# Altium schematic sheet 3-LoadDrivers.SchDoc
size A4
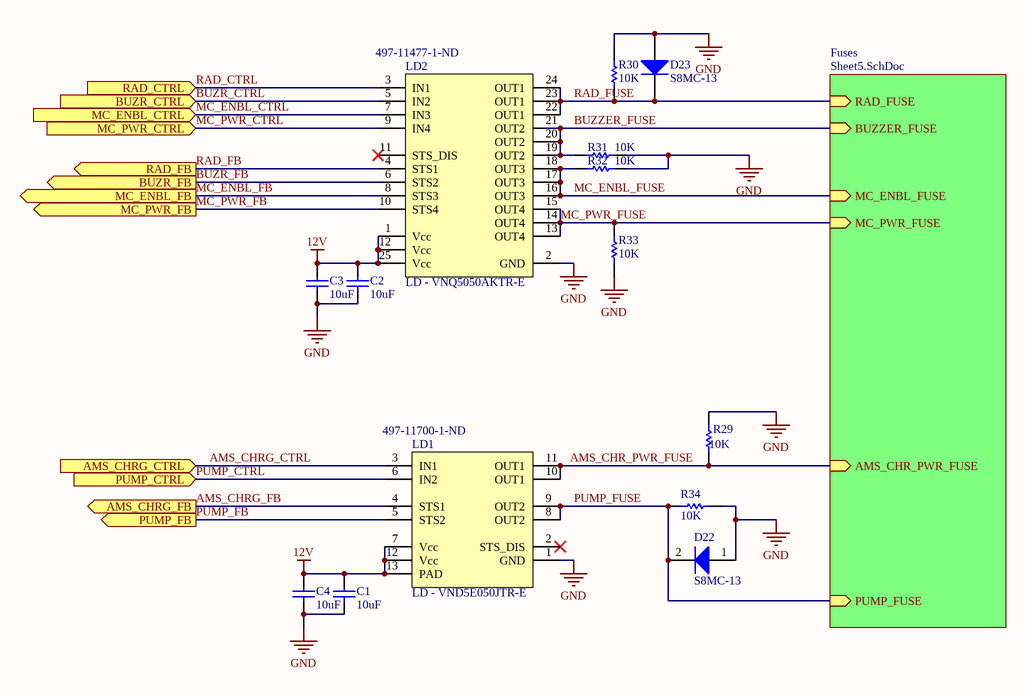
[diagram p0: 3-LoadDrivers.SchDoc]

## Parts
C1  value 10uF  [1608[0603]]  (hidden comment: Cap Semi)
C2  value 10uF  [1608[0603]]  (hidden comment: Cap Semi)
C3  value 10uF  [1608[0603]]  (hidden comment: Cap Semi)
C4  value 10uF  [1608[0603]]  (hidden comment: Cap Semi)
D22  S8MC-13  [S8MC-13]
D23  S8MC-13  [S8MC-13]
LD1  LD - VND5E050JTR-E  Supplier Part Number 1: 497-11700-1-ND
LD2  LD - VNQ5050AKTR-E  Supplier Part Number 1: 497-11477-1-ND  [24-SOP (0.295", 7.50mm Width) Exposed Pad]
R29  10K  [RESC0603(1608)_L]
R30  10K  [RESC0603(1608)_L]
R31  10K  [RESC0603(1608)_L]
R32  10K  [RESC0603(1608)_L]
R33  10K  [RESC0603(1608)_L]
R34  10K  [RESC0603(1608)_L]

## Sub-sheets
Fuses = Sheet5.SchDoc: RAD_FUSE (in), PUMP_FUSE (in), MC_PWR_FUSE (in), MC_ENBL_FUSE (in), BUZZER_FUSE (in), AMS_CHR_PWR_FUSE (in)

## Ports
AMS_CHRG_CTRL (in), AMS_CHRG_FB (out), BUZR_CTRL (in), BUZR_FB (out), MC_ENBL_CTRL (in), MC_ENBL_FB (out), MC_PWR_CTRL (in), MC_PWR_FB (out), PUMP_CTRL (in), PUMP_FB (out), RAD_CTRL (in), RAD_FB (out)

## Nets
12V: C1.2 C2.2 C3.2 C4.2 LD1.7(Vcc) LD1.12(Vcc) LD1.13(PAD) LD2.1(Vcc) LD2.12(Vcc) LD2.25(Vcc)
GND: C1.1 C2.1 C3.1 C4.1 D22.1(A) D23.1(A) LD1.1(GND) LD2.2(GND) R29.2 R30.2 R31.2 R32.2 R33.1 R34.1
AMS_CHR_PWR_FUSE: LD1.10(OUT1) LD1.11(OUT1) R29.1 ; sheet Fuses/AMS_CHR_PWR_FUSE
AMS_CHRG_CTRL: LD1.3(IN1) ; port AMS_CHRG_CTRL
AMS_CHRG_FB: LD1.4(STS1) ; port AMS_CHRG_FB
BUZR_CTRL: LD2.5(IN2) ; port BUZR_CTRL
BUZR_FB: LD2.6(STS2) ; port BUZR_FB
BUZZER_FUSE: LD2.19(OUT2) LD2.20(OUT2) LD2.21(OUT2) R31.1 ; sheet Fuses/BUZZER_FUSE
MC_ENBL_CTRL: LD2.7(IN3) ; port MC_ENBL_CTRL
MC_ENBL_FB: LD2.8(STS3) ; port MC_ENBL_FB
MC_ENBL_FUSE: LD2.16(OUT3) LD2.17(OUT3) LD2.18(OUT3) R32.1 ; sheet Fuses/MC_ENBL_FUSE
MC_PWR_CTRL: LD2.9(IN4) ; port MC_PWR_CTRL
MC_PWR_FB: LD2.10(STS4) ; port MC_PWR_FB
MC_PWR_FUSE: LD2.13(OUT4) LD2.14(OUT4) LD2.15(OUT4) R33.2 ; sheet Fuses/MC_PWR_FUSE
PUMP_CTRL: LD1.6(IN2) ; port PUMP_CTRL
PUMP_FB: LD1.5(STS2) ; port PUMP_FB
PUMP_FUSE: D22.2(K) LD1.8(OUT2) LD1.9(OUT2) R34.2 ; sheet Fuses/PUMP_FUSE
RAD_CTRL: LD2.3(IN1) ; port RAD_CTRL
RAD_FB: LD2.4(STS1) ; port RAD_FB
RAD_FUSE: D23.2(K) LD2.22(OUT1) LD2.23(OUT1) LD2.24(OUT1) R30.1 ; sheet Fuses/RAD_FUSE

Not connected (* = marked no-connect by the designer): LD1 2(STS_DIS)*; LD2 11(STS_DIS)*

## Library data of the parts
C1-C4 = Cap Semi: Capacitor (Semiconductor SIM Model); Published: 8-Jun-2000; LatestRevisionDate: 29-May-2009; LatestRevisionNote: IPC-7351 Footprint Added.; PackageReference: C1206; Publisher: Altium Limited; PackageDescription: Chip Capacitor; Supplier 1: Digi-Key; Supplier Part Number 1: 490-10991-1-ND
D22 D23 = Diode: Default Diode; Supplier 1: Digi-Key; Supplier Part Number 1: S8MCDICT-ND
LD1 = LOAD DRIVER - VND5E050JTR-E: Supplier 1: Digi-Key
LD2 = LOAD DRIVER - VNQ5050: Supplier 1: Digi-Key
R29-R34 = CMP-1591-00001-1: 0603 (1608 Metric) Chip Resistor; Case-Metric: 1608; Case-EIA: 0603; PackageReference: RESC0603(1608); Supplier 1: Digi-Key; Supplier Part Number 1: 311-10KGRCT-ND